# Altium schematic sheet 06. USB HOST.SchDoc
size A4; CheckedBy: 黄钦宁; Author: 陈坤; DocumentNumber: 6; SheetNumber: 6; SheetTotal: 13; PageSetup: Record=PageOptions|CenterHorizontal=True|CenterVertical=True|PrintScale=1.00|XCorrection=1.00|YCorrection=1.00|PrintKind=0|BorderSize=5000000|LeftOffset=0|BottomOffset=0|Orientation=2|PaperLength=1000|PaperWidth=1000|Scale=100|PaperSource=7|PrintQuality=600|MediaType=1|DitherType=10|PaperKind=A4|PrintScaleMode=1; DesignDate: 2013-08-16; CheckDate: 2013-12-28; SheetName: USB_HOST; SheetVersion: V1.00; SheetDescription: USB_HOST接口; ProductName: EasyARM-iMX28学习套件; ProductModel: EasyARM-iMX283
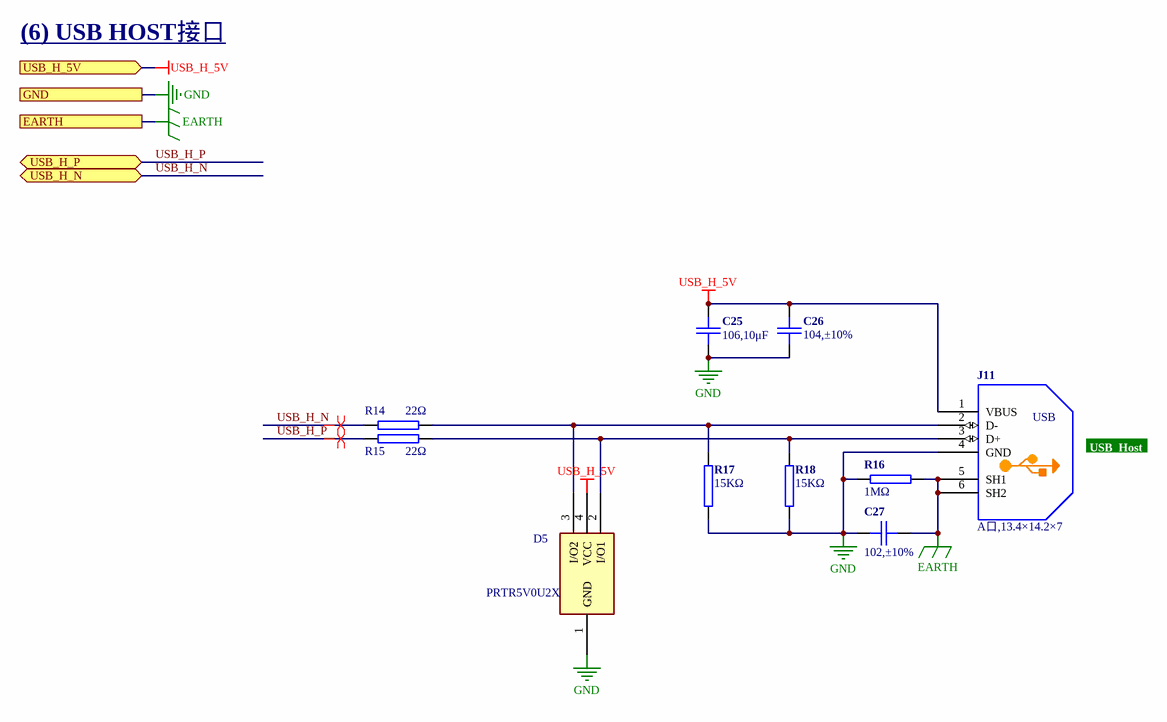
[diagram p0: 06. USB HOST.SchDoc]

## Parts
C25  106,10μF  [0805C]
C26  104,±10%  [0603C]
C27  102,±10%  [1206C]
D5  PRTR5V0U2X  [SOT-143]
J11  value A口,13.4×14.2×7  [USB-A]  (hidden comment: USB)
R14  22Ω  [0603R]
R15  22Ω  [0603R]
R16  1MΩ  [1206R]
R17  15KΩ  [0603R]
R18  15KΩ  [0603R]

## Ports
EARTH, GND, USB_H_5V, USB_H_N (bidir), USB_H_P (bidir)

## Nets
EARTH: C27.2 J11.5(SH1) J11.6(SH2) R16.2 ; port EARTH
GND: C25.2 C26.2 C27.1 D5.1(GND) J11.4(GND) R16.1 R17.1 R18.1 ; port GND
USB_H_5V: C25.1 C26.1 D5.4(VCC) J11.1(VBUS) ; port USB_H_5V
USB_H_N: R14.2 ; port USB_H_N
USB_H_P: R15.2 ; port USB_H_P
NetD5_2: D5.2(I/O1) J11.3(D+) R15.1 R18.2
NetD5_3: D5.3(I/O2) J11.2(D-) R14.1 R17.2

## Layout directives
differential pair: USB_H_N, USB_H_P

## Notes on the sheet
- (6) USB HOST接口
- USB_Host
- 1
- #
- 修改日期
- 修改内容
- 2
- 3
- 广州致远电子股份有限公司
- 设计人员
- 审核人员
- 设计日期
- 审核日期
- 产品名称
- 图纸名称
- 产品型号
- 图纸描述
- 图纸版本
- A4

## Library data of the parts
C25 = 1.02.02.0055: Capacitor; 名称: 电容; 规格型号: 106,10μF,±10%,10V,X5R,0805,RoHS; 封装: 0805; 设备封装名称: C0805_106_X5R_10V_10%; 贴片和直插: SMT; 现有库存: 36878; 物料代码: 1.02.02.0055; Value: 106,10μF; RoHS: RoHS; ComponentLink1Description: ErpDataInfo; ComponentLink1URL: http://erp.zlgmcu.com/ErpExt/ErpData/ListMateriel.aspx?pkey=1.02.02.0055
C26 = 1.02.01.0032: Capacitor; 名称: 电容; 规格型号: 104,±10%,50V,X7R,0603,*,RoHS; 贴片和直插: SMT; 现有库存: 1717054; 封装: 0603; 设备封装名称: C0603_104_X7R_50V_10%; 物料代码: 1.02.01.0032; Value: 104,±10%; RoHS: RoHS; ComponentLink1Description: ErpDataInfo; ComponentLink1URL: http://erp.zlgmcu.com/ErpExt/ErpData/ListMateriel.aspx?pkey=1.02.01.0032
C27 = 1.02.03.0003: Capacitor; 名称: 电容; 规格型号: 102,±10%,2KV,X7R,1206,*,RoHS; 封装: 1206; 设备封装名称: C1206_102_X7R_2KV_10%; 贴片和直插: SMT; 现有库存: 26517; 物料代码: 1.02.03.0003; Value: 102,±10%; RoHS: RoHS; ComponentLink1Description: ErpDataInfo; ComponentLink1URL: http://erp.zlgmcu.com/ErpExt/ErpData/ListMateriel.aspx?pkey=1.02.03.0003
D5 = 1.05.10.0153: PRTR5V0U2X,SOT-143B,NXP,RoHS; 名称: IC; 设备封装名称: SOT-143B_PRTR5V0U2X; 贴片和直插: SMT; 物料代码: 1.05.10.0153; Value: PRTR5V0U2X; 封装: SOT-143B; 厂商: NXP; RoHS: RoHS; 型号: PRTR5V0U2X; ComponentLink1Description: ErpDataInfo; ComponentLink1URL: http://erp.zlgmcu.com/ErpExt/ErpData/ListMateriel.aspx?pkey=1.05.10.0153
J11 = 1.10.05.0008: A口,13.4×14.2×7,90°,RoHS; Text Field1: 50; Text Field2: 60; 名称: USB插座; 贴片和直插: THT; 物料代码: 1.10.05.0008; RoHS: RoHS; 型号: A口,13.4×14.2×7,90°; ComponentLink1Description: ErpDataInfo; ComponentLink1URL: http://erp.zlgmcu.com/ErpExt/ErpData/ListMateriel.aspx?pkey=1.10.05.0008
R14 R15 = 1.01.01.0014: 名称: 电阻; 规格型号: 22Ω,0603,*,RoHS; 现有库存: 99098; 物料代码: 1.01.01.0014; Value: 22Ω; ComponentLink1Description: ErpDataInfo; ComponentLink1URL: http://192.168.0.2:8012/ErpExt/ErpData/ListMateriel.aspx?pkey=1.01.01.0014
R16 = 1.01.03.0019: 名称: 电阻; 规格型号: 1MΩ,1206,RoHS; 封装: 1206; 设备封装名称: R1206_1M; 贴片和直插: SMT; 现有库存: 12252; 物料代码: 1.01.03.0019; Value: 1MΩ; RoHS: RoHS; ComponentLink1Description: ErpDataInfo; ComponentLink1URL: http://erp.zlgmcu.com/ErpExt/ErpData/ListMateriel.aspx?pkey=1.01.03.0019
R17 R18 = 1.01.01.0054: 名称: 电阻; 规格型号: 15KΩ,0603,*,RoHS; 贴片和直插: SMT; 现有库存: 45635; 封装: 0603; 设备封装名称: R0603_15K; 物料代码: 1.01.01.0054; Value: 15KΩ; RoHS: RoHS; ComponentLink1Description: ErpDataInfo; ComponentLink1URL: http://erp.zlgmcu.com/ErpExt/ErpData/ListMateriel.aspx?pkey=1.01.01.0054